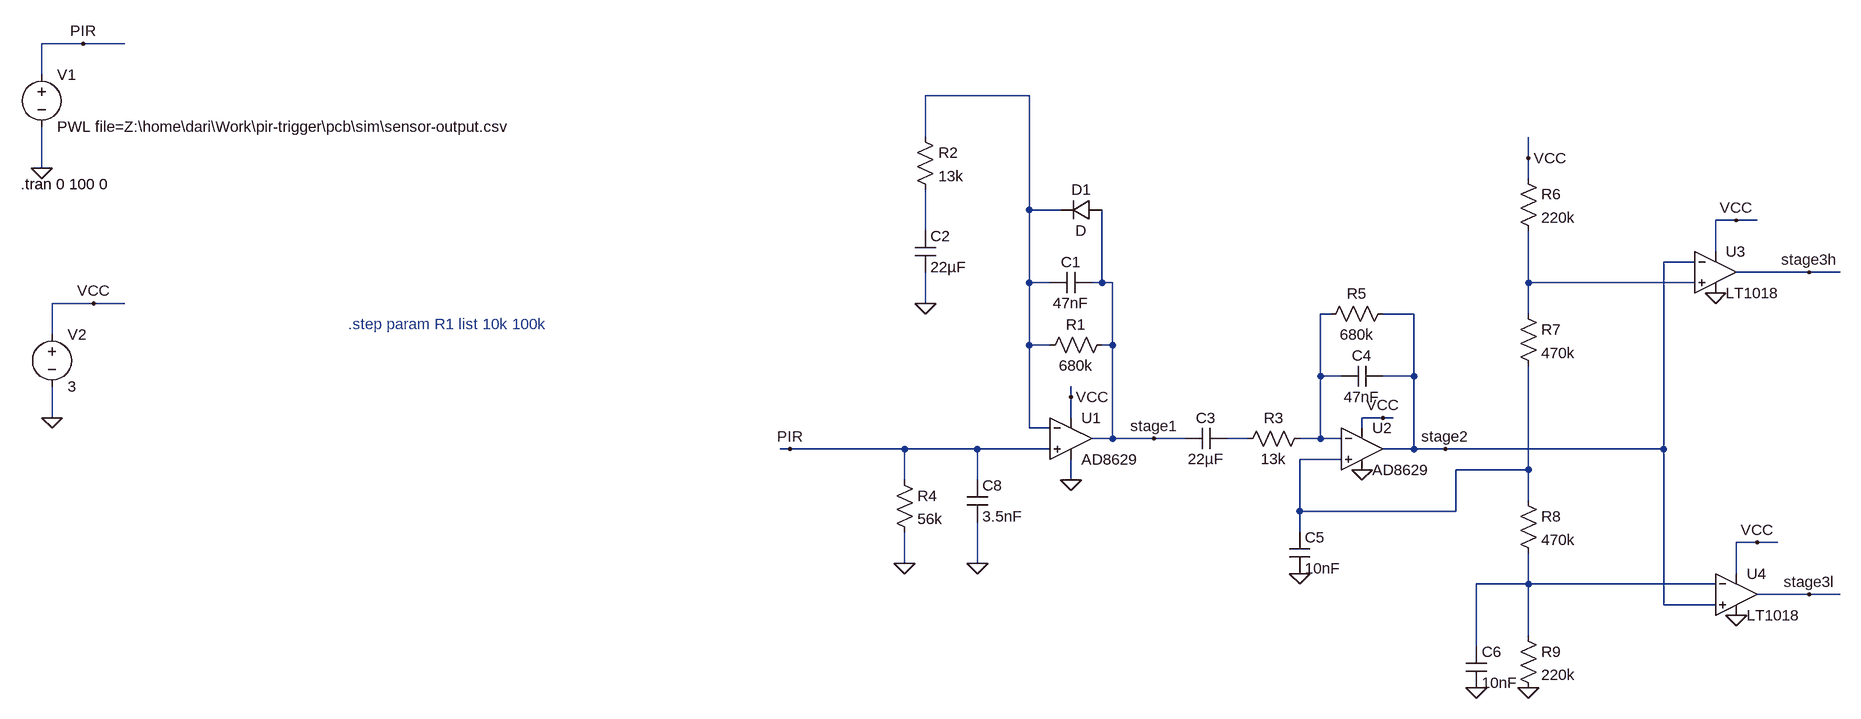
[diagram p0: schematic st-design.asc]
st-design.asc, the LTspice schematic file:
Version 4
SHEET 1 1668 680
WIRE -1264 -528 -1328 -528
WIRE -1200 -528 -1264 -528
WIRE -1328 -480 -1328 -528
WIRE 192 -448 32 -448
WIRE 32 -384 32 -448
WIRE 960 -352 960 -384
WIRE -1328 -336 -1328 -400
WIRE 960 -320 960 -352
WIRE 192 -272 192 -448
WIRE 240 -272 192 -272
WIRE 1280 -256 1248 -256
WIRE 1312 -256 1280 -256
WIRE 32 -240 32 -304
WIRE 1248 -208 1248 -256
WIRE 1216 -192 1168 -192
WIRE 1392 -176 1280 -176
WIRE 1440 -176 1392 -176
WIRE 192 -160 192 -272
WIRE 224 -160 192 -160
WIRE 304 -160 304 -272
WIRE 304 -160 288 -160
WIRE 320 -160 304 -160
WIRE 960 -160 960 -240
WIRE 1216 -160 960 -160
WIRE -1248 -128 -1312 -128
WIRE -1200 -128 -1248 -128
WIRE 32 -128 32 -176
WIRE 656 -112 640 -112
WIRE 784 -112 736 -112
WIRE 960 -112 960 -160
WIRE -1312 -80 -1312 -128
WIRE 192 -64 192 -160
WIRE 224 -64 192 -64
WIRE 320 -64 320 -160
WIRE 320 -64 304 -64
WIRE 640 -16 640 -112
WIRE 672 -16 640 -16
WIRE 784 -16 784 -112
WIRE 784 -16 736 -16
WIRE 256 16 256 0
WIRE -1312 48 -1312 0
WIRE 256 48 256 16
WIRE 736 48 704 48
WIRE 752 48 736 48
WIRE 192 64 192 -64
WIRE 224 64 192 64
WIRE 704 64 704 48
WIRE 320 80 320 -64
WIRE 320 80 288 80
WIRE 384 80 320 80
WIRE 432 80 384 80
WIRE 528 80 496 80
WIRE 640 80 640 -16
WIRE 640 80 608 80
WIRE 672 80 640 80
WIRE -176 96 -192 96
WIRE 0 96 -176 96
WIRE 112 96 0 96
WIRE 224 96 112 96
WIRE 784 96 784 -16
WIRE 784 96 736 96
WIRE 832 96 784 96
WIRE 1168 96 1168 -192
WIRE 1168 96 832 96
WIRE 672 112 608 112
WIRE 960 128 960 -32
WIRE 960 128 848 128
WIRE 0 144 0 96
WIRE 112 144 112 96
WIRE 256 144 256 112
WIRE 960 176 960 128
WIRE 608 192 608 112
WIRE 848 192 848 128
WIRE 848 192 608 192
WIRE 608 224 608 192
WIRE 1312 240 1280 240
WIRE 1344 240 1312 240
WIRE 0 272 0 224
WIRE 112 272 112 208
WIRE 1280 288 1280 240
WIRE 960 304 960 256
WIRE 960 304 880 304
WIRE 1248 304 960 304
WIRE 1392 320 1312 320
WIRE 1440 320 1392 320
WIRE 1168 336 1168 96
WIRE 1248 336 1168 336
WIRE 960 384 960 304
WIRE 880 400 880 304
FLAG -1328 -336 0
FLAG 256 144 0
FLAG -1264 -528 PIR
FLAG 0 272 0
FLAG 32 -128 0
FLAG -1312 48 0
FLAG -1248 -128 VCC
FLAG 384 80 stage1
FLAG 256 16 VCC
FLAG 608 288 0
FLAG 832 96 stage2
FLAG 704 128 0
FLAG 736 48 VCC
FLAG 1248 -144 0
FLAG 1280 352 0
FLAG 1280 -256 VCC
FLAG 1312 240 VCC
FLAG 960 -352 VCC
FLAG 960 464 0
FLAG 1392 -176 stage3h
FLAG 1392 320 stage3l
FLAG 112 272 0
FLAG -176 96 PIR
FLAG 880 464 0
SYMBOL voltage -1328 -496 R0
WINDOW 123 0 0 Left 2
WINDOW 39 0 0 Left 2
SYMATTR InstName V1
SYMATTR Value PWL file=Z:\home\dari\Work\pir-trigger\pcb\sim\sensor-output.csv
SYMBOL res -16 128 R0
SYMATTR InstName R4
SYMATTR Value 56k
SYMBOL res 320 -80 R90
WINDOW 0 0 56 VBottom 2
WINDOW 3 32 56 VTop 2
SYMATTR InstName R1
SYMATTR Value 680k
SYMBOL cap 288 -176 R90
WINDOW 0 0 32 VBottom 2
WINDOW 3 32 32 VTop 2
SYMATTR InstName C1
SYMATTR Value 47nF
SYMBOL res 16 -400 R0
SYMATTR InstName R2
SYMATTR Value 13k
SYMBOL cap 16 -240 R0
SYMATTR InstName C2
SYMATTR Value 22µF
SYMBOL voltage -1312 -96 R0
WINDOW 123 0 0 Left 2
WINDOW 39 0 0 Left 2
SYMATTR InstName V2
SYMATTR Value 3
SYMBOL cap 496 64 R90
WINDOW 0 0 32 VBottom 2
WINDOW 3 32 32 VTop 2
SYMATTR InstName C3
SYMATTR Value 22µF
SYMBOL res 624 64 R90
WINDOW 0 0 56 VBottom 2
WINDOW 3 32 56 VTop 2
SYMATTR InstName R3
SYMATTR Value 13k
SYMBOL cap 736 -32 R90
WINDOW 0 0 32 VBottom 2
WINDOW 3 32 32 VTop 2
SYMATTR InstName C4
SYMATTR Value 47nF
SYMBOL res 752 -128 R90
WINDOW 0 0 56 VBottom 2
WINDOW 3 32 56 VTop 2
SYMATTR InstName R5
SYMATTR Value 680k
SYMBOL cap 592 224 R0
SYMATTR InstName C5
SYMATTR Value 10nF
SYMBOL res 944 -336 R0
SYMATTR InstName R6
SYMATTR Value 220k
SYMBOL res 944 -128 R0
SYMATTR InstName R7
SYMATTR Value 470k
SYMBOL res 944 160 R0
SYMATTR InstName R8
SYMATTR Value 470k
SYMBOL res 944 368 R0
SYMATTR InstName R9
SYMATTR Value 220k
SYMBOL cap 96 144 R0
SYMATTR InstName C8
SYMATTR Value 3.5nF
SYMBOL Comparators\\LT1018 1248 -176 R0
SYMATTR InstName U3
SYMBOL Comparators\\LT1018 1280 320 R0
SYMATTR InstName U4
SYMBOL Opamps\\AD8629 256 16 R0
SYMATTR InstName U1
SYMBOL Opamps\\AD8629 704 32 R0
SYMATTR InstName U2
SYMBOL cap 864 400 R0
SYMATTR InstName C6
SYMATTR Value 10nF
SYMBOL diode 304 -288 R90
WINDOW 0 0 32 VBottom 2
WINDOW 3 32 32 VTop 2
SYMATTR InstName D1
TEXT -1360 -312 Left 2 !.tran 0 100 0
TEXT -856 -96 Left 2 ;.step param R1 list 10k 100k

The netlist it stands for:
* st-design.asc
V1 PIR 0 PWL file=Z:\home\dari\Work\pir-trigger\pcb\sim\sensor-output.csv
R4 PIR 0 56k
R1 stage1 N001 680k
C1 stage1 N001 47nF
R2 N001 N002 13k
C2 N002 0 22µF
V2 VCC 0 3
C3 N005 stage1 22µF
R3 N004 N005 13k
C4 stage2 N004 47nF
R5 stage2 N004 680k
C5 N006 0 10nF
R6 VCC N003 220k
R7 N003 N006 470k
R8 N006 N007 470k
R9 N007 0 220k
C8 PIR 0 3.5nF
XU3 N003 stage2 VCC 0 stage3h LT1018  ; pins In+ In- V+ V- OUT
XU4 stage2 N007 VCC 0 stage3l LT1018  ; pins In+ In- V+ V- OUT
XU1 PIR N001 VCC 0 stage1 AD8629  ; pins In+ In- V+ V- OUT
XU2 N006 N004 VCC 0 stage2 AD8629  ; pins In+ In- V+ V- OUT
C6 N007 0 10nF
D1 stage1 N001 D
.model D D
.lib standard.dio
.tran 0 100 0
* .step param R1 list 10k 100k
.lib LTC1.lib
.backanno
.end